# Altium schematic sheet 00. Root.SchDoc
size A2
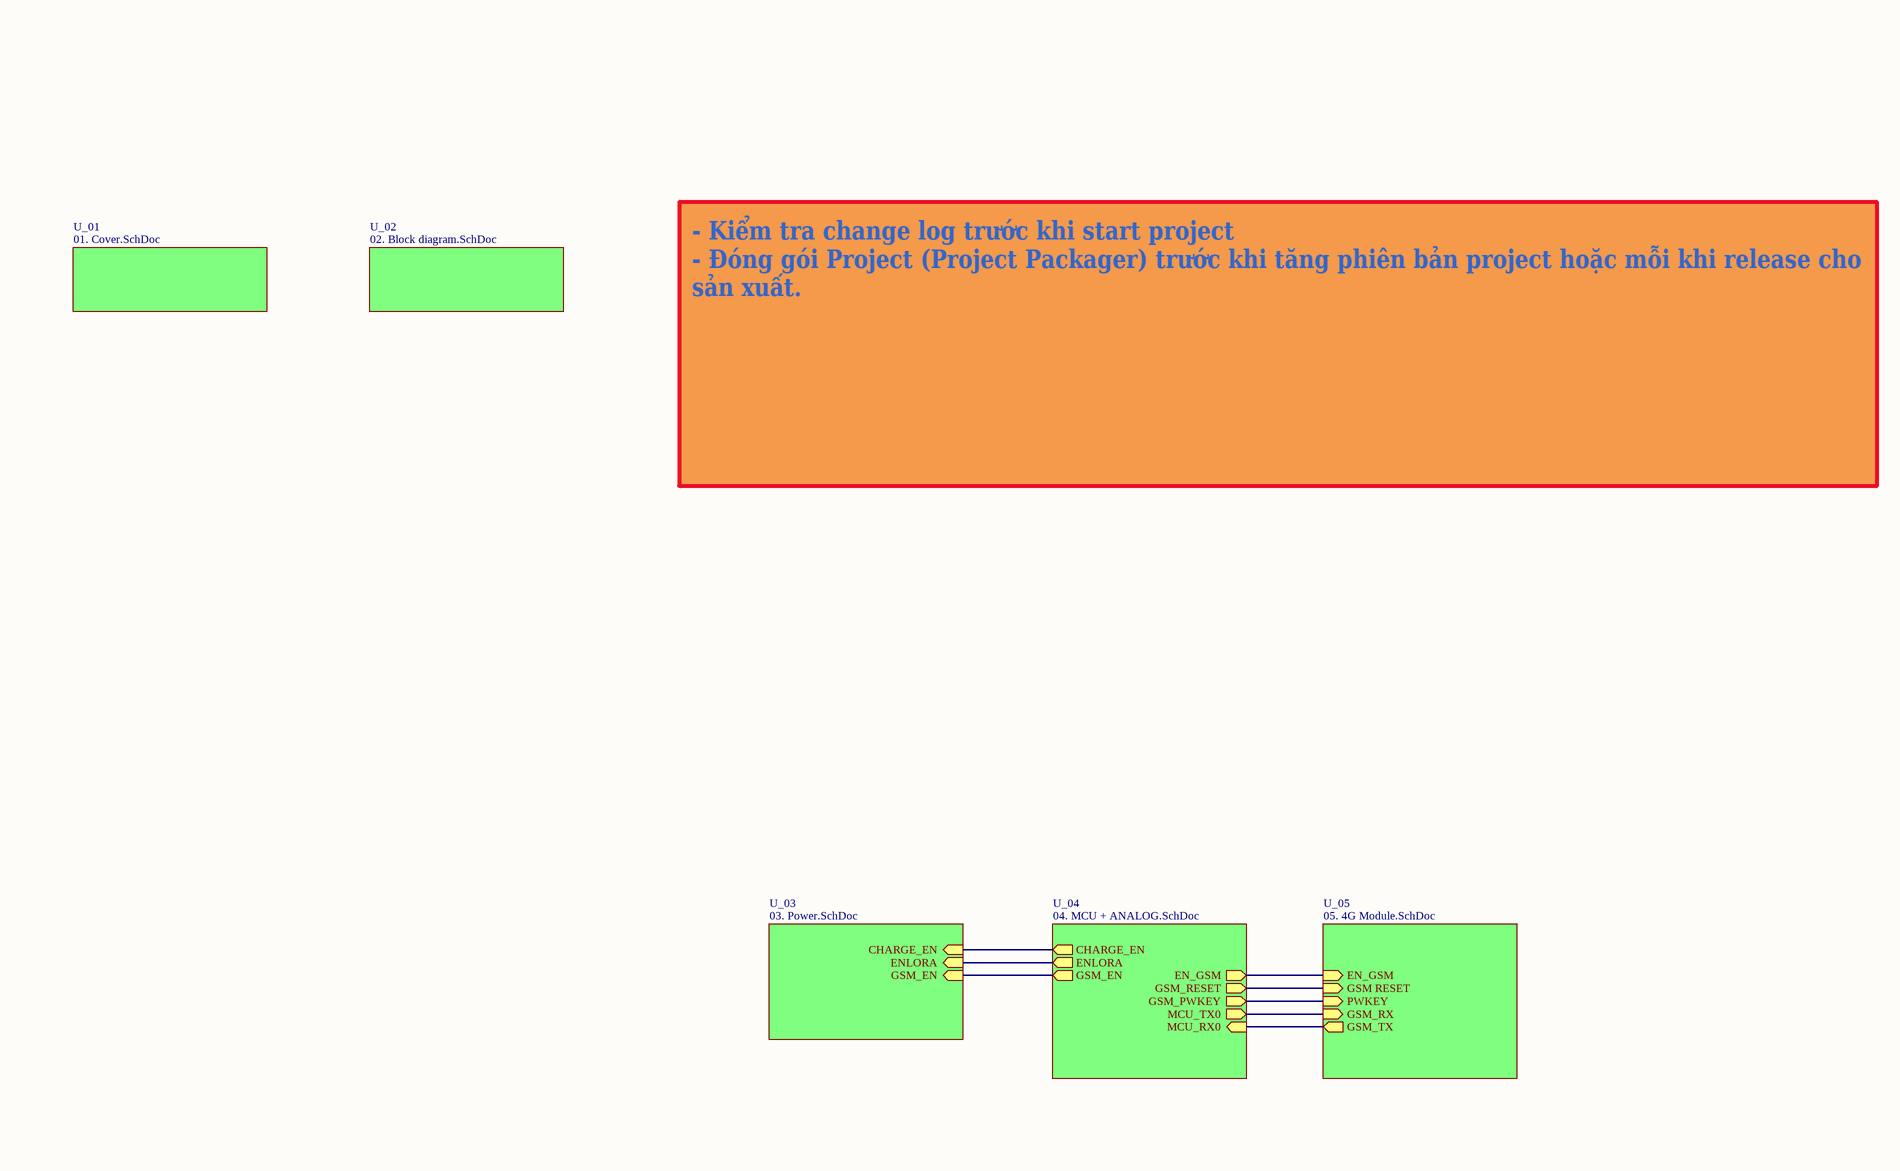
[diagram p0: 00. Root.SchDoc, left]
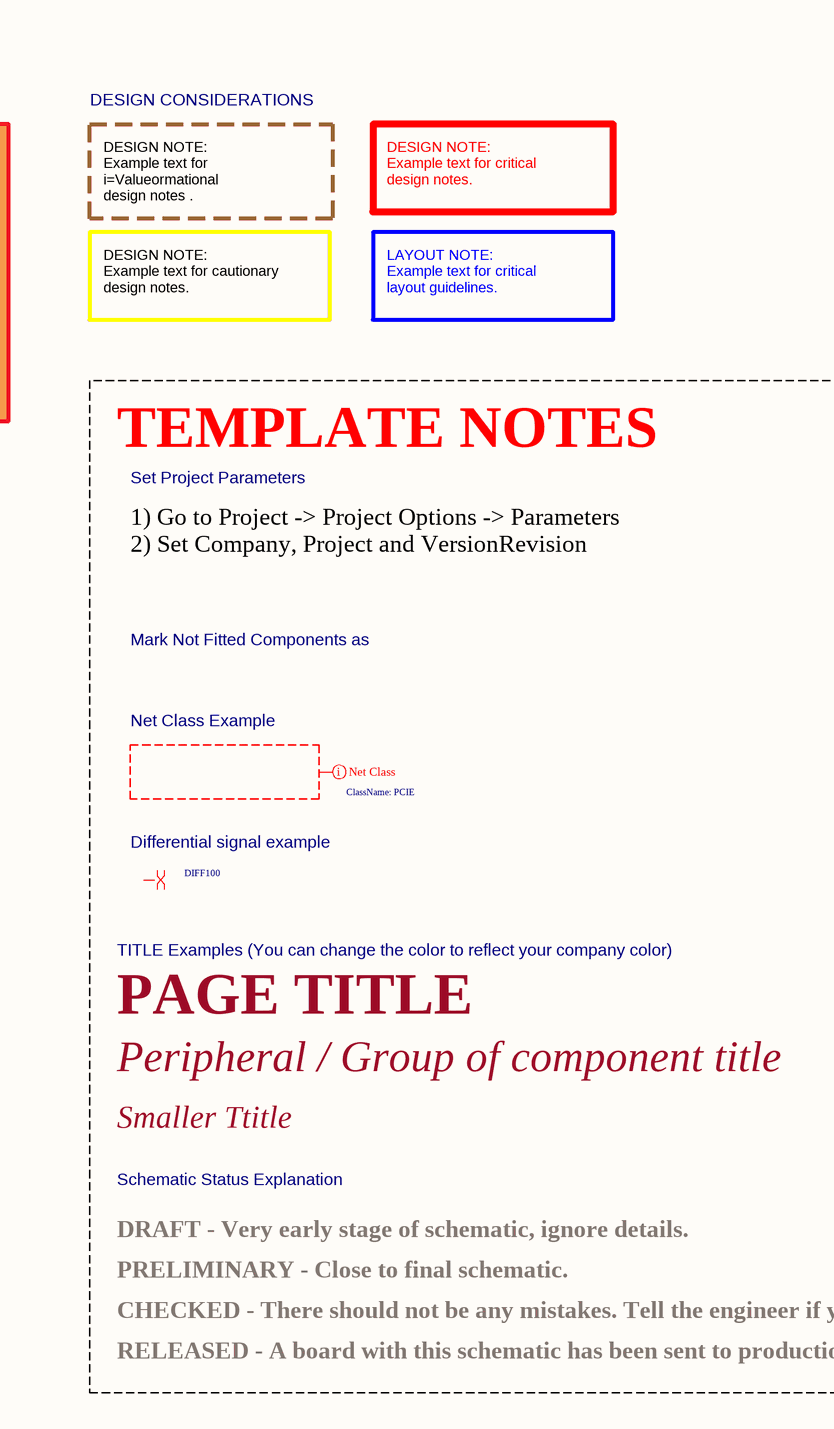
[diagram p1: 00. Root.SchDoc, right]

## Sub-sheets
U_01 = 01. Cover.SchDoc: no entries
U_02 = 02. Block diagram.SchDoc: no entries
U_03 = 03. Power.SchDoc: CHARGE_EN (in), ENLORA (in), GSM_EN (in)
U_04 = 04. MCU + ANALOG.SchDoc: GSM_PWKEY (out), GSM_EN (out), GSM_RESET (out), MCU_TX0 (out), MCU_RX0 (in), ENLORA (out), CHARGE_EN (out), EN_GSM (out)
U_05 = 05. 4G Module.SchDoc: GSM_RX (in), GSM_TX (out), GSM RESET (in), PWKEY (in), EN_GSM (in)

## Nets
(unnamed): sheet U_03/CHARGE_EN, sheet U_04/CHARGE_EN
(unnamed): sheet U_03/ENLORA, sheet U_04/ENLORA
(unnamed): sheet U_03/GSM_EN, sheet U_04/GSM_EN
(unnamed): sheet U_04/GSM_PWKEY, sheet U_05/PWKEY
(unnamed): sheet U_04/GSM_RESET, sheet U_05/GSM RESET
(unnamed): sheet U_04/MCU_TX0, sheet U_05/GSM_RX
(unnamed): sheet U_04/MCU_RX0, sheet U_05/GSM_TX
(unnamed): sheet U_04/EN_GSM, sheet U_05/EN_GSM

## Layout directives
net class PCIE: (no net found under the mark)
differential pair; net class DIFF100: (no net found under the mark)

## Notes on the sheet
- DESIGN CONSIDERATIONS
- DESIGN NOTE:
  Example text for i=Valueormational
  design notes .
- DESIGN NOTE:
  Example text for critical
  design notes.
- DESIGN NOTE:
  Example text for cautionary
  design notes.
- LAYOUT NOTE:
  Example text for critical
  layout guidelines.
- - Kiểm tra change log trước khi start project
  - Đóng gói Project (Project Packager) trước khi tăng phiên bản project hoặc mỗi khi release cho sản xuất.
- TEMPLATE NOTES
- Set Project Parameters
- 1) Go to Project -> Project Options -> Parameters
  2) Set Company, Project and VersionRevision
- Mark Not Fitted Components as
- Net Class Example
- Differential signal example
- TITLE Examples (You can change the color to reflect your company color)
- PAGE TITLE
- Peripheral / Group of component title
- Smaller Ttitle
- Schematic Status Explanation
- DRAFT - Very early stage of schematic, ignore details.
- PRELIMINARY - Close to final schematic.
- RELEASED - A board with this schematic has been sent to production.
- CHECKED - There should not be any mistakes. Tell the engineer if you find one.
- File:
- Project:
- REV:
- Sheet:
- Drawn By:
- Size:
- A2
- DRAFT
- Checked By:
- Approved By: